# EAGLE schematic schematic (EAGLE 7.3.0)
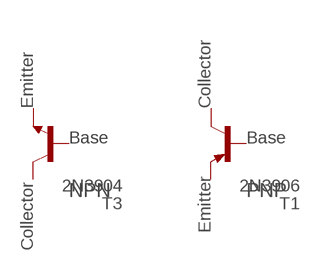
[diagram p0: schematic, sheet 1]

## Parts
T1  2N3906  [TO92]
T3  2N3904  [TO92]
Unconnected: T1.1(B) T1.2(C) T1.3(E) T3.1(C) T3.2(B) T3.3(E)

## Notes on the sheet
- Emitter | Collector
- Base | Base
- NPN | PNP
- Emitter
- Collector

## Library data of the parts
T1 = transistor:2N3906: PNP TRANSISTOR
T3 = transistor:2N3904: NPN TRANSISTOR